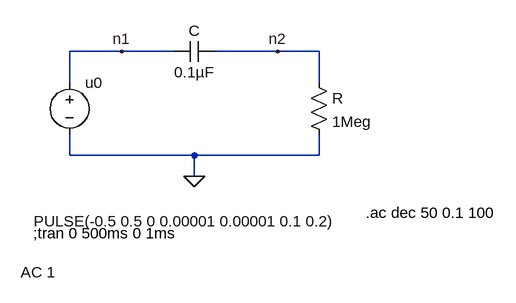
[diagram p0: schematic lab1_prep_3-2_schematic.asc]
lab1_prep_3-2_schematic.asc, the LTspice schematic file:
Version 4
SHEET 1 880 680
WIRE 0 -896 -80 -896
WIRE 80 -896 0 -896
WIRE 240 -896 144 -896
WIRE 304 -896 240 -896
WIRE -80 -848 -80 -896
WIRE 304 -848 304 -896
WIRE -80 -736 -80 -768
WIRE 112 -736 -80 -736
WIRE 304 -736 304 -768
WIRE 304 -736 112 -736
WIRE 112 -704 112 -736
FLAG 112 -704 0
FLAG 0 -896 n1
FLAG 240 -896 n2
SYMBOL cap 80 -880 R270
WINDOW 0 32 32 VTop 2
WINDOW 3 0 32 VBottom 2
SYMATTR InstName C
SYMATTR Value 0.1µF
SYMBOL res 288 -864 R0
SYMATTR InstName R
SYMATTR Value 1Meg
SYMBOL voltage -80 -864 R0
WINDOW 3 -55 229 Left 2
WINDOW 123 -75 308 Left 2
WINDOW 39 0 0 Left 0
SYMATTR Value PULSE(-0.5 0.5 0 0.00001 0.00001 0.1 0.2)
SYMATTR Value2 AC 1
SYMATTR InstName u0
TEXT -136 -616 Left 2 !;tran 0 500ms 0 1ms
TEXT 376 -648 Left 2 !.ac dec 50 0.1 100

The netlist it stands for:
* lab1_prep_3-2_schematic.asc
C n1 n2 0.1µF
R n2 0 1Meg
V§u0 n1 0 PULSE(-0.5 0.5 0 0.00001 0.00001 0.1 0.2) AC 1
;tran 0 500ms 0 1ms
.ac dec 50 0.1 100
.backanno
.end